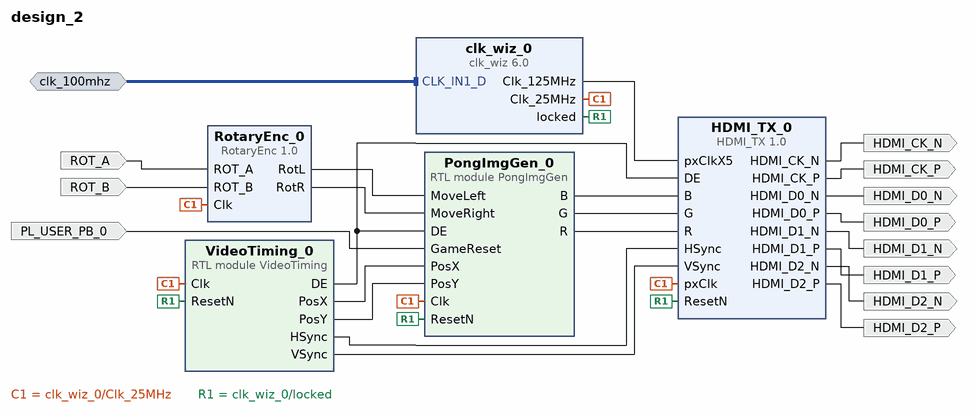
[diagram p0: block diagram of the top level]
# Vivado block design design_2, xczu3eg-sfvc784-2-e, Vivado 2025.2
create_bd_design design_2

create_bd_intf_port -mode Slave -vlnv xilinx.com:interface:diff_clock_rtl:1.0 clk_100mhz
create_bd_port -dir I PL_USER_PB_0
create_bd_port -dir I ROT_A
create_bd_port -dir I ROT_B
create_bd_port -dir O HDMI_D0_P
create_bd_port -dir O HDMI_D0_N
create_bd_port -dir O HDMI_CK_N
create_bd_port -dir O HDMI_CK_P
create_bd_port -dir O HDMI_D2_N
create_bd_port -dir O HDMI_D2_P
create_bd_port -dir O HDMI_D1_N
create_bd_port -dir O HDMI_D1_P

create_bd_cell -type module -reference PongImgGen PongImgGen_0
create_bd_cell -type module -reference VideoTiming VideoTiming_0
create_bd_cell -type ip -vlnv JS_WUST:UCiSW:RotaryEnc:1.0 RotaryEnc_0
create_bd_cell -type ip -vlnv JS_WUST:UCiSW:HDMI_TX:1.0 HDMI_TX_0
create_bd_cell -type ip -vlnv xilinx.com:ip:clk_wiz:6.0 clk_wiz_0
set_property -dict [list \
  CONFIG.CLKOUT1_JITTER 148.007 \
  CONFIG.CLKOUT1_PHASE_ERROR 84.520 \
  CONFIG.CLKOUT1_REQUESTED_OUT_FREQ 25 \
  CONFIG.CLKOUT2_JITTER 107.502 \
  CONFIG.CLKOUT2_PHASE_ERROR 84.520 \
  CONFIG.CLKOUT2_REQUESTED_OUT_FREQ 125 \
  CONFIG.CLKOUT2_USED true \
  CONFIG.CLK_IN1_BOARD_INTERFACE clk_100mhz \
  CONFIG.CLK_OUT1_PORT Clk_25MHz \
  CONFIG.CLK_OUT2_PORT Clk_125MHz \
  CONFIG.MMCM_CLKFBOUT_MULT_F 12.500 \
  CONFIG.MMCM_CLKOUT0_DIVIDE_F 50.000 \
  CONFIG.MMCM_CLKOUT1_DIVIDE 10 \
  CONFIG.NUM_OUT_CLKS 2 \
  CONFIG.PRIM_SOURCE Differential_clock_capable_pin \
  CONFIG.USE_RESET false \
] [get_bd_cells clk_wiz_0]

# ---- connections ----

connect_bd_intf_net -intf_net CLK_IN1_D_0_1 [get_bd_intf_ports clk_100mhz] [get_bd_intf_pins clk_wiz_0/CLK_IN1_D]
connect_bd_net -net GameReset_0_1 [get_bd_ports PL_USER_PB_0] [get_bd_pins PongImgGen_0/GameReset]
connect_bd_net [get_bd_pins HDMI_TX_0/HDMI_CK_N] [get_bd_ports HDMI_CK_N]
connect_bd_net [get_bd_pins HDMI_TX_0/HDMI_CK_P] [get_bd_ports HDMI_CK_P]
connect_bd_net [get_bd_pins HDMI_TX_0/HDMI_D0_N] [get_bd_ports HDMI_D0_N]
connect_bd_net [get_bd_pins HDMI_TX_0/HDMI_D0_P] [get_bd_ports HDMI_D0_P]
connect_bd_net [get_bd_pins HDMI_TX_0/HDMI_D1_N] [get_bd_ports HDMI_D1_N]
connect_bd_net [get_bd_pins HDMI_TX_0/HDMI_D1_P] [get_bd_ports HDMI_D1_P]
connect_bd_net [get_bd_pins HDMI_TX_0/HDMI_D2_N] [get_bd_ports HDMI_D2_N]
connect_bd_net [get_bd_pins HDMI_TX_0/HDMI_D2_P] [get_bd_ports HDMI_D2_P]
connect_bd_net [get_bd_pins VideoTiming_0/DE] [get_bd_pins HDMI_TX_0/DE] [get_bd_pins PongImgGen_0/DE]
connect_bd_net [get_bd_pins PongImgGen_0/B] [get_bd_pins HDMI_TX_0/B]
connect_bd_net [get_bd_pins PongImgGen_0/G] [get_bd_pins HDMI_TX_0/G]
connect_bd_net [get_bd_pins PongImgGen_0/R] [get_bd_pins HDMI_TX_0/R]
connect_bd_net -net ROT_A_0_1 [get_bd_ports ROT_A] [get_bd_pins RotaryEnc_0/ROT_A]
connect_bd_net -net ROT_B_0_1 [get_bd_ports ROT_B] [get_bd_pins RotaryEnc_0/ROT_B]
connect_bd_net [get_bd_pins RotaryEnc_0/RotL] [get_bd_pins PongImgGen_0/MoveLeft]
connect_bd_net [get_bd_pins RotaryEnc_0/RotR] [get_bd_pins PongImgGen_0/MoveRight]
connect_bd_net [get_bd_pins VideoTiming_0/HSync] [get_bd_pins HDMI_TX_0/HSync]
connect_bd_net [get_bd_pins VideoTiming_0/PosX] [get_bd_pins PongImgGen_0/PosX]
connect_bd_net [get_bd_pins VideoTiming_0/PosY] [get_bd_pins PongImgGen_0/PosY]
connect_bd_net [get_bd_pins VideoTiming_0/VSync] [get_bd_pins HDMI_TX_0/VSync]
connect_bd_net [get_bd_pins clk_wiz_0/Clk_125MHz] [get_bd_pins HDMI_TX_0/pxClkX5]
connect_bd_net [get_bd_pins clk_wiz_0/Clk_25MHz] \
  [get_bd_pins HDMI_TX_0/pxClk] [get_bd_pins RotaryEnc_0/Clk] [get_bd_pins VideoTiming_0/Clk] [get_bd_pins PongImgGen_0/Clk]
connect_bd_net [get_bd_pins clk_wiz_0/locked] [get_bd_pins HDMI_TX_0/ResetN] [get_bd_pins VideoTiming_0/ResetN] [get_bd_pins PongImgGen_0/ResetN]

validate_bd_design
save_bd_design
